# EAGLE design Black_Sesame (EAGLE 9.6.0)
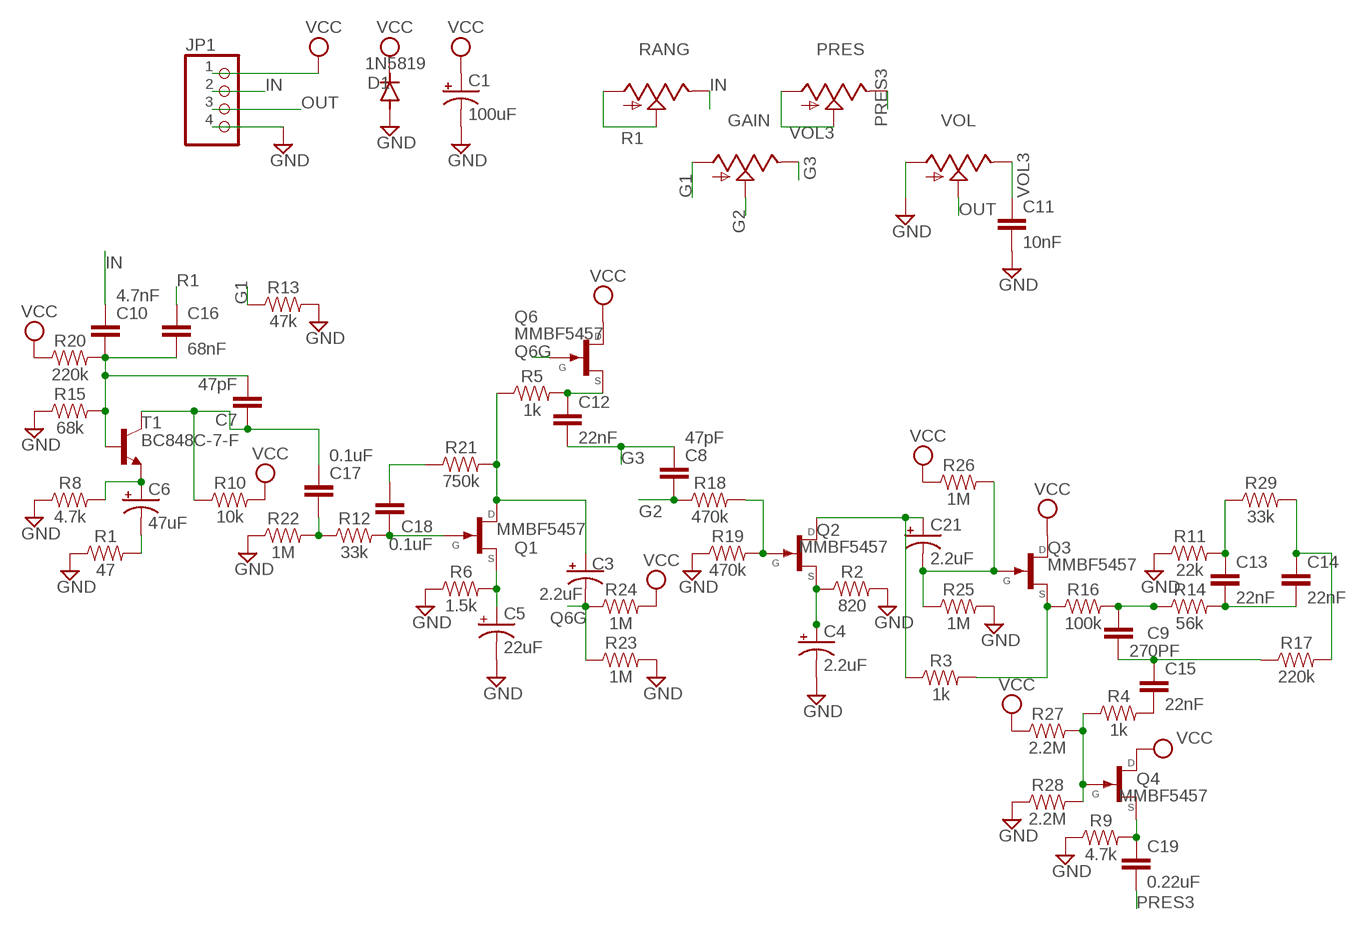
[diagram p0: schematic, sheet 1]

## Parts
C1  100uF  CAP_SMD+THRUPAN_B  [PAN_B_SMD+THRU]
C3  2.2uF  CAP_SMD+THRUPAN_B  [PAN_B_SMD+THRU]
C4  2.2uF  CAP_SMD+THRUPAN_B  [PAN_B_SMD+THRU]
C5  22uF  CAP_SMD+THRUPAN_B  [PAN_B_SMD+THRU]
C6  47uF  CAP_SMD+THRUPAN_B  [PAN_B_SMD+THRU]
C7  47pF  47PF-0603-50V-5%  [0603]
C8  47pF  47PF-0603-50V-5%  [0603]
C9  270PF  270PF-0603-50V-5%  [0603]
C10  4.7nF  3.3NF-0603-100V-10%  [0603]
C11  10nF  10NF-0603-50V-10%  [0603]
C12  22nF  22NF/22,000PF-0603-50V-10%  [0603]
C13  22nF  22NF/22,000PF-0603-50V-10%  [0603]
C14  22nF  22NF/22,000PF-0603-50V-10%  [0603]
C15  22nF  22NF/22,000PF-0603-50V-10%  [0603]
C16  68nF  47NF-0603-25V-5%  [0603]
C17  0.1uF  0.1UF-0603-25V-(+80/-20%)  [0603]
C18  0.1uF  0.1UF-0603-25V-(+80/-20%)  [0603]
C19  0.22uF  0.22UF-0603-25V-10%  [0603]
C21  2.2uF  CAP_SMD+THRUPAN_B  [PAN_B_SMD+THRU]
D1  1N5819  DIODE-SOD123  [SOD123]
GAIN  9MM_SNAP-IN_POT_  [9MM_SNAP-IN_POT]
JP1  PINHD-1X4  [1X04]
PRES  9MM_SNAP-IN_POT_  [9MM_SNAP-IN_POT]
Q1  MMBF5457  [SOT23]
Q2  MMBF5457  [SOT23]
Q3  MMBF5457  [SOT23]
Q4  MMBF5457  [SOT23]
Q6  MMBF5457  [SOT23]
R1  47  47KOHM-0603-1/10W-1%  [0603]
R2  820  82OHM-0603-1/10W-1%  [0603]
R3  1k  1KOHM-0603-1/10W-1%  [0603]
R4  1k  1KOHM-0603-1/10W-1%  [0603]
R5  1k  1KOHM-0603-1/10W-1%  [0603]
R6  1.5k  1KOHM-0603-1/10W-1%  [0603]
R8  4.7k  4.7KOHM-0603-1/10W-1%  [0603]
R9  4.7k  4.7KOHM-0603-1/10W-1%  [0603]
R10  10k  10KOHM-0603-1/10W-1%  [0603]
R11  22k  22KOHM-0603-1/10W-1%  [0603]
R12  33k  33KOHM-0603-1/10W-1%  [0603]
R13  47k  47KOHM-0603-1/10W-1%  [0603]
R14  56k  62KOHM-0603-1/10W-5%  [0603]
R15  68k  68.1KOHM-0603-1/10W-1%  [0603]
R16  100k  100KOHM-0603-1/10W-1%  [0603]
R17  220k  220KOHM-0603-1/10W-1%  [0603]
R18  470k  470OHM-0603-1/10W-1%  [0603]
R19  470k  470OHM-0603-1/10W-1%  [0603]
R20  220k  220KOHM-0603-1/10W-1%  [0603]
R21  750k  750OHM-0603-1/10W-1%  [0603]
R22  1M  1MOHM-0603-1/4W-5%  [0603]
R23  1M  1MOHM-0603-1/4W-5%  [0603]
R24  1M  1MOHM-0603-1/4W-5%  [0603]
R25  1M  1MOHM-0603-1/4W-5%  [0603]
R26  1M  1MOHM-0603-1/4W-5%  [0603]
R27  2.2M  2.2OHM-0603-1/10W-5%  [0603]
R28  2.2M  2.2OHM-0603-1/10W-5%  [0603]
R29  33k  33KOHM-0603-1/10W-1%  [0603]
RANG  9MM_SNAP-IN_POT_  [9MM_SNAP-IN_POT]
T1  BC848C-7-F  BC817-16-NPN-SOT23-BEC  [SOT23-BEC]
VOL  9MM_SNAP-IN_POT_  [9MM_SNAP-IN_POT]

## Nets
G1: GAIN.1(A) R13.1
G2: C8.2 GAIN.2(S) R18.1
G3: C8.1 C12.2 GAIN.3(E)
GND: C1.- C1.--(-) C4.- C4.--(-) C5.- C5.--(-) C11.2 D1.A JP1.4 R1.1 R2.2 R6.1 R8.1 R9.1 R11.1 R13.2 R15.1 R19.1 R22.1 R23.2 R25.2 R28.1 VOL.1(A)
IN: C10.1 JP1.2 RANG.3(E)
N$1: C7.2 C10.2 C16.2 R15.2 R20.2 T1.B
N$2: C7.1 C17.1 R10.1 T1.C
N$3: C6.+ C6.++(+) R8.2 T1.E
N$4: C6.- C6.--(-) R1.2
N$5: C17.2 R12.1 R22.2
N$6: C18.1 Q1.3(G) R12.2
N$7: C3.+ C3.++(+) Q1.1(D) R5.1 R21.2
N$8: C18.2 R21.1
N$9: C5.+ C5.++(+) Q1.2(S) R6.2
N$10: Q2.3(G) R18.2 R19.2
N$11: C12.1 Q6.2(S) R5.2
N$12: C4.+ C4.++(+) Q2.2(S) R2.1
N$13: C21.- C21.--(-) Q3.3(G) R25.1 R26.2
N$14: C21.+ C21.++(+) Q2.1(D) R3.1
N$15: Q3.2(S) R3.2 R16.1
N$16: C9.1 R14.1 R16.2
N$17: C13.2 C14.2 R14.2
N$18: C13.1 R11.2 R29.1
N$19: C14.1 R17.2 R29.2
N$20: C9.2 C15.1 R17.1
N$21: C15.2 R4.2
N$22: Q4.3(G) R4.1 R27.2 R28.2
N$23: C19.1 Q4.2(S) R9.2
OUT: JP1.3 VOL.2(S)
PRES3: C19.2 PRES.3(E)
Q6G: C3.- C3.--(-) Q6.3(G) R23.1 R24.1
R1: C16.1 RANG.1(A) RANG.2(S)
VCC: C1.+ C1.++(+) D1.C JP1.1 Q3.1(D) Q4.1(D) Q6.1(D) R10.2 R20.1 R24.2 R26.1 R27.1
VOL3: C11.1 PRES.1(A) PRES.2(S) VOL.3(E)

## Library data of the parts
C1 C3-C6 C21 = MusicThingModular:CAP_SMD+THRU
C7 C8 = SparkFun-Capacitors:47PF: 47pF ceramic capacitors A capacitor is a passive two-terminal electrical component used to store electrical energy temporarily in an electric field.; PROD_ID: CAP-08913
C9 = SparkFun-Capacitors:270PF: 270pF/0.27nF ceramic capacitors A capacitor is a passive two-terminal electrical component used to store electrical energy temporarily in an electric field.; PROD_ID: CAP-13339
C10 = SparkFun-Capacitors:3.3NF: 3.3nF ceramic capacitors A capacitor is a passive two-terminal electrical component used to store electrical energy temporarily in an electric field.; PROD_ID: CAP-09633; VALUE: 3.3nF
C11 = SparkFun-Capacitors:10NF: 0.01uF/10nF/10,000pF ceramic capacitors A capacitor is a passive two-terminal electrical component used to store electrical energy temporarily in an electric field. CAP-09321; PROD_ID: CAP-00867
C12-C15 = SparkFun-Capacitors:22NF/22,000PF: 0.022uF/22nF/22,000pF ceramic capacitors A capacitor is a passive two-terminal electrical component used to store electrical energy temporarily in an electric field.; PROD_ID: CAP-07885
C16 = SparkFun-Capacitors:47NF: 47nF ceramic capacitors A capacitor is a passive two-terminal electrical component used to store electrical energy temporarily in an electric field.; PROD_ID: CAP-08605; VALUE: 47nF
C17 C18 = SparkFun-Capacitors:0.1UF: 0.1µF ceramic capacitors A capacitor is a passive two-terminal electrical component used to store electrical energy temporarily in an electric field.; PROD_ID: CAP-00810
C19 = SparkFun-Capacitors:0.22UF: 0.22µF ceramic capacitors A capacitor is a passive two-terminal electrical component used to store electrical energy temporarily in an electric field.; PROD_ID: CAP-07822
D1 = diode:DIODE-: DIODE
GAIN PRES RANG VOL = MusicThingModular:9MM_SNAP-IN_POT: 9mm vertical snap-in pot, Alpha / Panasonic style
JP1 = Connector:PINHD-1X4: PIN HEADER; CATEGORY: CONNECTOR; SUB-CATEGORY: PIN-HEADER
Q1-Q4 Q6 = MMBF5457:MMBF5457*: N-Channel JFET; AVAILABILITY: Unavailable; DESCRIPTION: JFET N-Channel 25V 350mW Surface Mount SOT-23-3; MF: ON Semiconductor; MP: MMBF5457; PACKAGE: SOT-23-3 Fairchild Semiconductor; PRICE: None
R1 = SparkFun-Resistors:47KOHM: 47kΩ resistor A resistor is a passive two-terminal electrical component that implements electrical resistance as a circuit element. Resistors act to reduce current flow, and, at the same time, act to lower voltage levels within circuits. - Wikipedia; PROD_ID: RES-07871; VALUE: 47k
R2 = SparkFun-Resistors:82OHM: 82Ω resistor A resistor is a passive two-terminal electrical component that implements electrical resistance as a circuit element. Resistors act to reduce current flow, and, at the same time, act to lower voltage levels within circuits. - Wikipedia; PROD_ID: RES-12311; VALUE: 82
R3-R5 = SparkFun-Resistors:1KOHM: 1kΩ resistor A resistor is a passive two-terminal electrical component that implements electrical resistance as a circuit element. Resistors act to reduce current flow, and, at the same time, act to lower voltage levels within circuits. - Wikipedia; PROD_ID: RES-07856
R6 = SparkFun-Resistors:1KOHM: 1kΩ resistor A resistor is a passive two-terminal electrical component that implements electrical resistance as a circuit element. Resistors act to reduce current flow, and, at the same time, act to lower voltage levels within circuits. - Wikipedia; PROD_ID: RES-07856; VALUE: 1k
R8 R9 = SparkFun-Resistors:4.7KOHM: 4.7kΩ resistor A resistor is a passive two-terminal electrical component that implements electrical resistance as a circuit element. Resistors act to reduce current flow, and, at the same time, act to lower voltage levels within circuits. - Wikipedia; PROD_ID: RES-07857
R10 = SparkFun-Resistors:10KOHM: 10kΩ resistor A resistor is a passive two-terminal electrical component that implements electrical resistance as a circuit element. Resistors act to reduce current flow, and, at the same time, act to lower voltage levels within circuits. - Wikipedia; PROD_ID: RES-00824
R11 = SparkFun-Resistors:22KOHM: 22kΩ resistor A resistor is a passive two-terminal electrical component that implements electrical resistance as a circuit element. Resistors act to reduce current flow, and, at the same time, act to lower voltage levels within circuits. - Wikipedia; PROD_ID: RES-07853
R12 R29 = SparkFun-Resistors:33KOHM: 33kΩ resistor A resistor is a passive two-terminal electrical component that implements electrical resistance as a circuit element. Resistors act to reduce current flow, and, at the same time, act to lower voltage levels within circuits. - Wikipedia; PROD_ID: RES-08416
R13 = SparkFun-Resistors:47KOHM: 47kΩ resistor A resistor is a passive two-terminal electrical component that implements electrical resistance as a circuit element. Resistors act to reduce current flow, and, at the same time, act to lower voltage levels within circuits. - Wikipedia; PROD_ID: RES-07871
R14 = SparkFun-Resistors:62KOHM: 62kΩ resistor A resistor is a passive two-terminal electrical component that implements electrical resistance as a circuit element. Resistors act to reduce current flow, and, at the same time, act to lower voltage levels within circuits. - Wikipedia
R15 = SparkFun-Resistors:68.1KOHM: 68.1kΩ resistor A resistor is a passive two-terminal electrical component that implements electrical resistance as a circuit element. Resistors act to reduce current flow, and, at the same time, act to lower voltage levels within circuits. - Wikipedia; PROD_ID: RES-09380; VALUE: 68.1k
R16 = SparkFun-Resistors:100KOHM: 100kΩ resistor A resistor is a passive two-terminal electrical component that implements electrical resistance as a circuit element. Resistors act to reduce current flow, and, at the same time, act to lower voltage levels within circuits. - Wikipedia; PROD_ID: RES-07828
R17 R20 = SparkFun-Resistors:220KOHM: 220kΩ resistor A resistor is a passive two-terminal electrical component that implements electrical resistance as a circuit element. Resistors act to reduce current flow, and, at the same time, act to lower voltage levels within circuits. - Wikipedia; PROD_ID: RES-08969
R18 R19 = SparkFun-Resistors:470OHM: 470Ω resistor A resistor is a passive two-terminal electrical component that implements electrical resistance as a circuit element. Resistors act to reduce current flow, and, at the same time, act to lower voltage levels within circuits. - Wikipedia; PROD_ID: RES-07869; VALUE: 470
R21 = SparkFun-Resistors:750OHM: 750Ω resistor A resistor is a passive two-terminal electrical component that implements electrical resistance as a circuit element. Resistors act to reduce current flow, and, at the same time, act to lower voltage levels within circuits. - Wikipedia; PROD_ID: RES-07824; VALUE: 750
R22-R26 = SparkFun-Resistors:1MOHM: 1MΩ resistor A resistor is a passive two-terminal electrical component that implements electrical resistance as a circuit element. Resistors act to reduce current flow, and, at the same time, act to lower voltage levels within circuits. - Wikipedia; PROD_ID: RES-07868
R27 R28 = SparkFun-Resistors:2.2OHM: 2.2Ω resistor A resistor is a passive two-terminal electrical component that implements electrical resistance as a circuit element. Resistors act to reduce current flow, and, at the same time, act to lower voltage levels within circuits. - Wikipedia; PROD_ID: RES-07823; VALUE: 2.2
T1 = MusicThingModular:*-NPN-: NPN Transistror BF959 corrected 2008.03.06

## Board
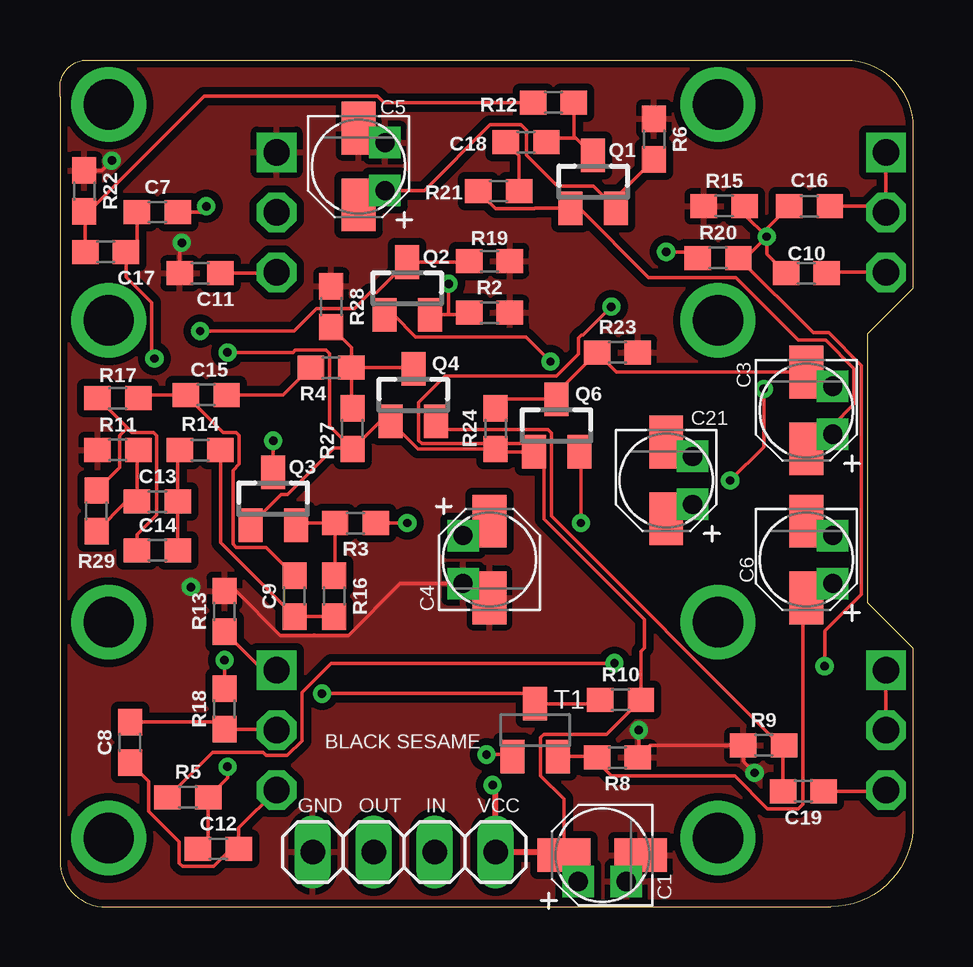
[diagram p1: board, top side]
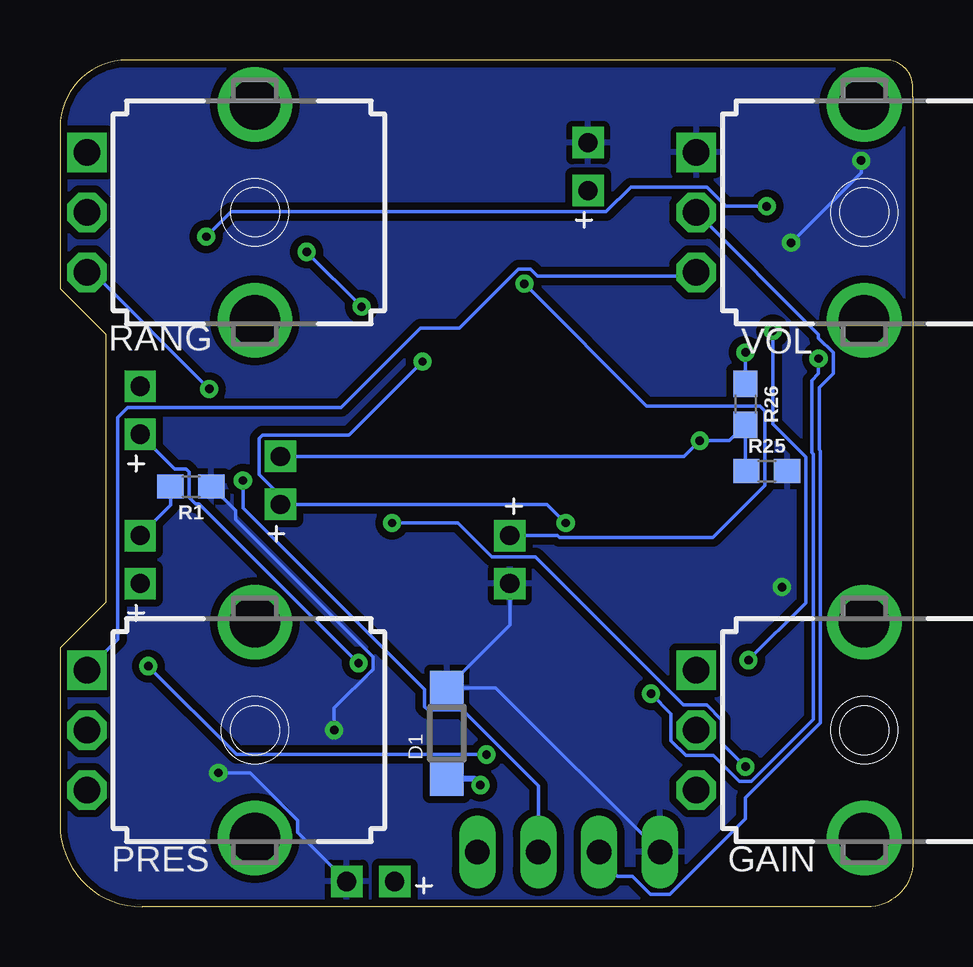
[diagram p2: board, bottom side, seen from below]

Size 35.56 x 35.31 mm. Coordinates in mm from the lower left corner, seen from the top.
Outline: 1.91,0 32.13,0 arc90 35.56,3.43 35.56,10.79 33.66,12.7 33.66,23.88 35.56,25.78 35.56,32.51 arc90 32.77,35.31 1.14,35.31 arc90 0,34.16 0,33.78 0,1.91 arc90 1.91,0
Copper layers (1*16): Top 0.035mm / dielectric 1.5mm / Bottom 0.035mm
Design rules "default *": minimum track width 6mil, minimum drill 0.35mm, track to track 6mil, track to pad 6mil, pad to pad 6mil, via to via 6mil, smd to smd 6mil, copper to edge 6mil, drill to drill 6mil, minimum pad ring 10mil, minimum via ring 8mil, stop-mask expansion 4mil, vias tented up to drill 0mil, thermal gap 10mil

### Footprints (pad centres in the part's own frame; a part is rotated, then mirrored left to right if it is on the bottom)
PAN_B_SMD+THRU = smd 2.2 x 1.4: + 1.6,0; - -1.6,0 | drill 0.8 pad 0.9 square: ++ 1,1.1; -- -1,1.1
0603 = smd 1.1 x 1: 1 -0.85,0; 2 0.85,0
SOD123 = smd 1.4 x 1.4: A 1.9,0; C -1.9,0
9MM_SNAP-IN_POT = drill 1.1 square: 1 -2.5,-7 | drill 1.1 octagon: 2 0,-7; 3 2.5,-7 | drill 2.1 pad 2.794: CHASSIS1 -4.5,0; CHASSIS2 4.5,0
1X04 = drill 1.016 long: 1 -3.81,0; 2 -1.27,0; 3 1.27,0; 4 3.81,0
SOT23 = smd 1 x 1.4: 1 -0.95,-1.1; 2 0.95,-1.1; 3 0,1.1
SOT23-BEC = smd 1 x 1.4: B -0.95,-1.1; C 0,1.1; E 0.95,-1.1

### Placement (x,y rotation side)
C1  22.61,2.16 180 top
C3  31.11,20.7 270 top
C4  17.91,14.48 90 top
C5  12.45,30.86 270 top
C6  31.11,14.48 270 top
C7  4.06,28.96 0 top
C8  2.92,6.86 90 top
C9  9.78,12.95 90 top
C10  31.11,26.42 180 top
C11  5.84,26.42 180 top
C12  6.6,2.41 0 top
C13  4.06,16.89 0 top
C14  4.06,14.86 0 top
C15  6.1,21.34 0 top
C16  31.24,29.21 180 top
C17  1.91,27.3 180 top
C18  19.43,31.88 180 top
C19  30.99,4.83 0 top
C21  25.27,17.78 270 top
D1  19.43,7.24 90 bottom
GAIN  2.03,7.37 270 bottom
JP1  14.35,2.29 180 top
PRES  27.43,7.37 270 bottom
Q1  22.23,30.23 0 top
Q2  14.48,25.78 0 top
Q3  8.89,17.02 0 top
Q4  14.73,21.34 0 top
Q6  20.7,20.07 0 top
R1  30.1,17.53 180 bottom
R2  17.91,24.77 0 top
R3  12.32,16 180 top
R4  11.3,22.48 180 top
R5  5.33,4.57 0 top
R6  24.77,32 270 top
R8  23.24,6.22 180 top
R9  29.34,6.73 0 top
R10  23.37,8.64 0 top
R11  2.41,19.05 0 top
R12  20.57,33.53 0 top
R13  6.86,12.32 90 top
R14  5.84,19.05 180 top
R15  27.69,29.21 0 top
R16  11.43,12.95 270 top
R17  2.41,21.21 180 top
R18  6.86,8.26 90 top
R19  17.91,26.92 180 top
R20  27.43,27.05 0 top
R21  18.29,29.84 180 top
R22  1.02,29.84 270 top
R23  23.24,23.11 0 top
R24  18.16,19.94 270 top
R25  6.1,18.16 0 bottom
R26  6.99,20.95 270 bottom
R27  12.19,19.94 90 top
R28  11.3,25.02 270 top
R29  1.52,16.51 90 top
RANG  27.43,28.96 270 bottom
T1  19.81,7.37 0 top
VOL  2.03,28.96 270 bottom

### Tracks (layer width: path | path; a pad name or v marks a point on that pad's centre or on a via)
G1
  Top 0.152: R13.1 8.46,9.87 GAIN.1
G2
  Top 0.152: R18.1 6.99,7.41 | 6.99,7.41 8.99,7.41 GAIN.2 | C8.2 6.68,7.71 6.99,7.41
G3
  Top 0.152: GAIN.3 7.45,3.29 C12.2 7.13,2.41 6.4,1.68 5.11,1.68 4.97,1.82 4.97,2.71 3.71,3.98 3.71,5.22 C8.1
GND  (via drill 0.35)
  Top 0.152: R13.2 7.34,13.17 9.18,11.32 12.03,11.32 14.18,13.48 C4.-- | C1.- 24.21,1.66 C1.-- | v28.96,5.59 28.49,6.06 R9.1 24.6,6.73 R8.1 24.13,6.26 v24.13,7.37 | C11.2 4.99,27.6 v5.08,27.69 | v2.16,31.11 1.74,30.7 R22.1
  Bottom 0.152: C4.-- 16.81,11.76 D1.A 17.39,9.14 JP1.4 | C1.-- 25.64,3.1 25.64,3.61 27.63,5.59 v28.96,5.59 | v5.08,27.69 2.16,30.61 v2.16,31.11 | R1.1 28.24,16.52 28.24,16.14 22.51,10.41 22.51,9.91 24.13,8.29 v24.13,7.37
  other vias: 5.46,13.34
  pour Top (isolate 0.305): -0.25,35.56 -0.25,-0.76 35.81,-0.76 36.07,-1.02 36.07,35.81 0,35.81
  pour Bottom (isolate 0.305): -0.25,35.81 -0.25,-0.76 36.07,-0.76 36.07,35.81
IN  (via drill 0.35)
  Top 0.152: C10.1 32.01,26.46 RANG.3 | v29.34,21.59 29.34,19.18 v27.93,17.77
  Bottom 0.152: JP1.2 15.62,5.05 18.78,8.21 20.23,8.21 20.36,8.34 20.36,9.06 27.93,16.63 v27.93,17.77 | v29.34,21.59 34.2,26.46 RANG.3
N$1  (via drill 0.35)
  Top 0.152: C7.2 5.84,28.96 v6.1,29.21 | v29.46,27.94 29.46,28.28 C16.2 | v31.88,10.03 31.88,11.51 33.4,13.03 33.4,22.58 32.04,23.93 31.4,23.93 R20.2 28.57,27.05 v29.46,27.94 | v17.78,6.35 18.78,6.35 T1.B | v29.46,27.94 29.46,27.22 C10.2 | v29.46,27.94 28.54,28.87 R15.2
  Bottom 0.152: v6.1,29.21 7.8,29.21 8.6,30.01 11.77,30.01 12.8,28.98 28.43,28.98 v29.46,27.94 | v31.88,10.03 28.19,6.35 v17.78,6.35
N$2  (via drill 0.35)
  Top 0.152: C7.1 3.21,27.76 C17.1 2.75,26.26 3.82,25.2 3.82,22.98 v3.94,22.86 | R10.1 22.35,8.47 T1.C 19.39,8.89 v10.92,8.89
  Bottom 0.152: v3.94,22.86 3.94,22.23 4.21,21.95 4.21,18.93 4.16,18.88 4.16,7.81 6.73,5.24 7.24,5.24 8.31,6.31 9.47,6.31 10.09,6.93 10.09,8.05 v10.92,8.89
N$3
  Top 0.152: T1.E 22.35,6.27 | 22.35,6.27 R8.2 | C6.++ 31.61,12.88 C6.+ 30.97,12.73 30.97,4.28 30.78,4.1 29.49,4.1 28.13,5.46 22.99,5.46 22.35,6.1 22.35,6.27
N$4
  Top 0.152: C6.- 31.61,16.08 C6.--
  Bottom 0.152: C6.-- 30.95,16.74 R1.2
N$5
  Top 0.152: R22.2 1.05,28.96 1.05,28.83 | 1.05,28.83 C17.2 | R12.1 13.5,33.53 13.24,33.79 6.02,33.79 1.05,28.83
N$6
  Top 0.152: Q1.3 21.5,32.05 | 21.5,32.05 21.42,32.13 R12.2 | 21.5,32.05 20.45,32.05 C18.1
N$7  (via drill 0.35)
  Top 0.152: C3.+ 31.71,19.7 C3.++ 32.22,20.07 33.1,20.95 33.1,22.45 31.92,23.63 30.79,23.63 28.17,26.24 24.54,26.24 21.65,29.13 Q1.1 19.79,29.13 19.78,29.12 18.17,29.12 R21.2 | v23.11,10.16 11.3,10.16 10.09,8.95 10.09,6.93 9.47,6.31 8.6,6.31 8.46,6.45 6.36,6.45 R5.1
  Bottom 0.152: C3.++ 30.77,18.25 30.3,18.25 30.17,18.12 30.17,17.07 29.89,16.8 29.75,16.8 v23.11,10.16
N$8
  Top 0.152: C18.2 19.14,31.32 R21.1
N$9
  Top 0.152: C5.+ 12.95,29.26 C5.++ 15.19,29.86 17.94,32.61 19.23,32.61 19.44,32.39 19.44,31.34 20.73,30.05 22.25,30.05 Q1.2 23.18,29.56 R6.2
N$10  (via drill 0.35)
  Top 0.152: R19.2 17.01,26.88 Q2.3 13.21,25.61 12.93,25.61 12.27,24.95 10.71,24.95 9.76,24 v5.84,24 | v6.86,10.29 R18.2
  Bottom 0.152: v5.84,24 5.84,20.13 4.47,18.76 4.47,12.68 v6.86,10.29
N$11  (via drill 0.35)
  Top 0.152: C12.1 6.18,2.84 R5.2 6.99,5.37 v6.99,5.84 | v21.72,16 21.72,18.9 Q6.2
  Bottom 0.152: v6.99,5.84 7.98,6.83 7.98,7.8 8.6,8.42 9.56,8.42 15.74,14.6 17.56,14.6 18.96,16 v21.72,16
N$12  (via drill 0.35)
  Top 0.152: C4.+ 17.31,15.48 C4.++ | Q2.2 16.26,24.68 | 16.26,24.68 16.97,24.68 R2.1 | v16.2,25.98 16.2,24.74 16.26,24.68
  Bottom 0.152: C4.++ 14.81,15.48 14.73,15.39 8.34,15.39 6.17,17.57 6.17,20.66 6.39,20.88 11.11,20.88 v16.2,25.98
N$13  (via drill 0.35)
  Top 0.152: Q3.3 v8.89,19.43 | C21.-- 25.77,19.38 C21.-
  Bottom 0.152: R25.1 6.99,18.2 R26.2 7.66,19.43 v8.89,19.43 9.54,18.78 C21.--
N$14  (via drill 0.35)
  Top 0.152: C21.+ 25.77,16.18 C21.++ | Q2.1 13.9,24.68 14.83,23.75 19.43,23.75 v20.45,22.73 | R3.1 v14.48,16
  Bottom 0.152: v20.45,22.73 23.52,19.66 27.12,19.66 27.26,19.53 27.26,18.03 26.37,17.15 C21.++ 15.26,16.78 v14.48,16
N$15
  Top 0.152: Q3.2 9.92,16 R3.2 11.47,13.84 R16.1
N$16
  Top 0.152: R14.1 6.69,15.19 C9.1 R16.2
N$17
  Top 0.152: C14.2 C13.2 4.91,18.97 R14.2
N$18
  Top 0.152: R11.2 3.21,19 C13.1 2.75,16.89 R29.1
N$19
  Top 0.152: C14.1 3.21,15.52 4.04,16.34 4.04,19.64 3.91,19.78 2.99,19.78 2.75,20.02 | 2.75,20.02 R17.2 | R29.2 2.48,18.32 2.48,19.64 2.75,19.91 2.75,20.02
N$20
  Top 0.152: R17.1 3.39,21.34 C15.1 6.8,19.78 7.34,19.78 7.47,19.64 7.47,18.45 7.21,18.2 7.21,15.12 7.34,14.99 8.59,14.99 C9.2
N$21
  Top 0.152: R4.2 9.31,21.34 C15.2
N$22
  Top 0.152: R27.2 12.15,20.83 R4.1 | R4.1 14.69,22.48 Q4.3 | R28.2 12.15,23.32 R4.1
N$23
  Top 0.152: C19.1 30.14,6.68 R9.2 30.04,6.73 20.48,16.29 20.48,19.76 20.35,19.89 16.02,19.89 Q4.2
OUT
  Bottom 0.152: JP1.3 13.08,2.03 12.32,1.27 11.69,1.27 10.95,0.53 10.13,0.53 6.99,3.68 6.99,4.55 3.86,7.68 3.86,19.01 3.91,19.06 3.91,21.65 3.33,22.23 3.33,23.11 3.94,23.72 3.94,23.86 VOL.2
PRES3
  Top 0.152: PRES.3 34.39,4.83 C19.2
Q6G
  Top 0.152: R24.1 18.54,21.17 Q6.3 20.7,21.42 R23.1 23.2,22.3 C3.- 31.71,21.7 C3.--
R1
  Top 0.152: C16.1 34.18,29.21 RANG.2 RANG.1
VCC  (via drill 0.35)
  Top 0.152: 12.24,19.13 R27.1 11.23,20.05 11.23,23.07 11.1,23.21 9.81,23.21 9.71,23.11 v6.99,23.11 | 12.24,19.13 13.34,20.24 Q4.1 14.93,19.09 R24.2 18.28,18.97 19.68,18.97 | 19.68,18.97 Q6.1 19.41,19.31 15.09,19.31 14.95,19.44 14.95,21.03 16.05,22.13 20.7,22.13 21.61,23.04 21.61,23.71 21.75,23.84 21.81,23.84 v22.99,25.02 | Q3.1 9.21,17.19 9.48,17.19 11.43,19.13 12.24,19.13 | C1.+ 21.01,4.5 20.03,5.47 20.03,7.06 20.17,7.2 22.78,7.2 R10.2 24.22,10.66 24.36,10.8 24.36,11.98 20.18,16.17 20.18,18.48 19.68,18.97 | v25.27,27.3 26.33,27.3 R20.1
  Top 0.254: C1.++ 21.61,1.56 C1.+ 20.88,2.29 JP1.1 18.16,4.95 v18.03,5.08
  Bottom 0.152: v6.99,23.11 R26.1 | v22.99,25.02 v25.27,27.3
  Bottom 0.254: v18.03,5.08 18.29,5.34 D1.C
VOL3
  Top 0.152: PRES.1 PRES.2 | C11.1 8.99,26.42 VOL.3
  Bottom 0.152: PRES.1 33.15,11.15 33.15,20.4 32.73,20.82 23.84,20.82 20.53,24.13 18.91,24.13 16.45,26.59 15.95,26.59 15.65,26.29 9.2,26.29 VOL.3

### Text on the board
tPlace: BLACK SESAME | GND | OUT | IN | VCC